# EAGLE design bluetooth (EAGLE 6.1)
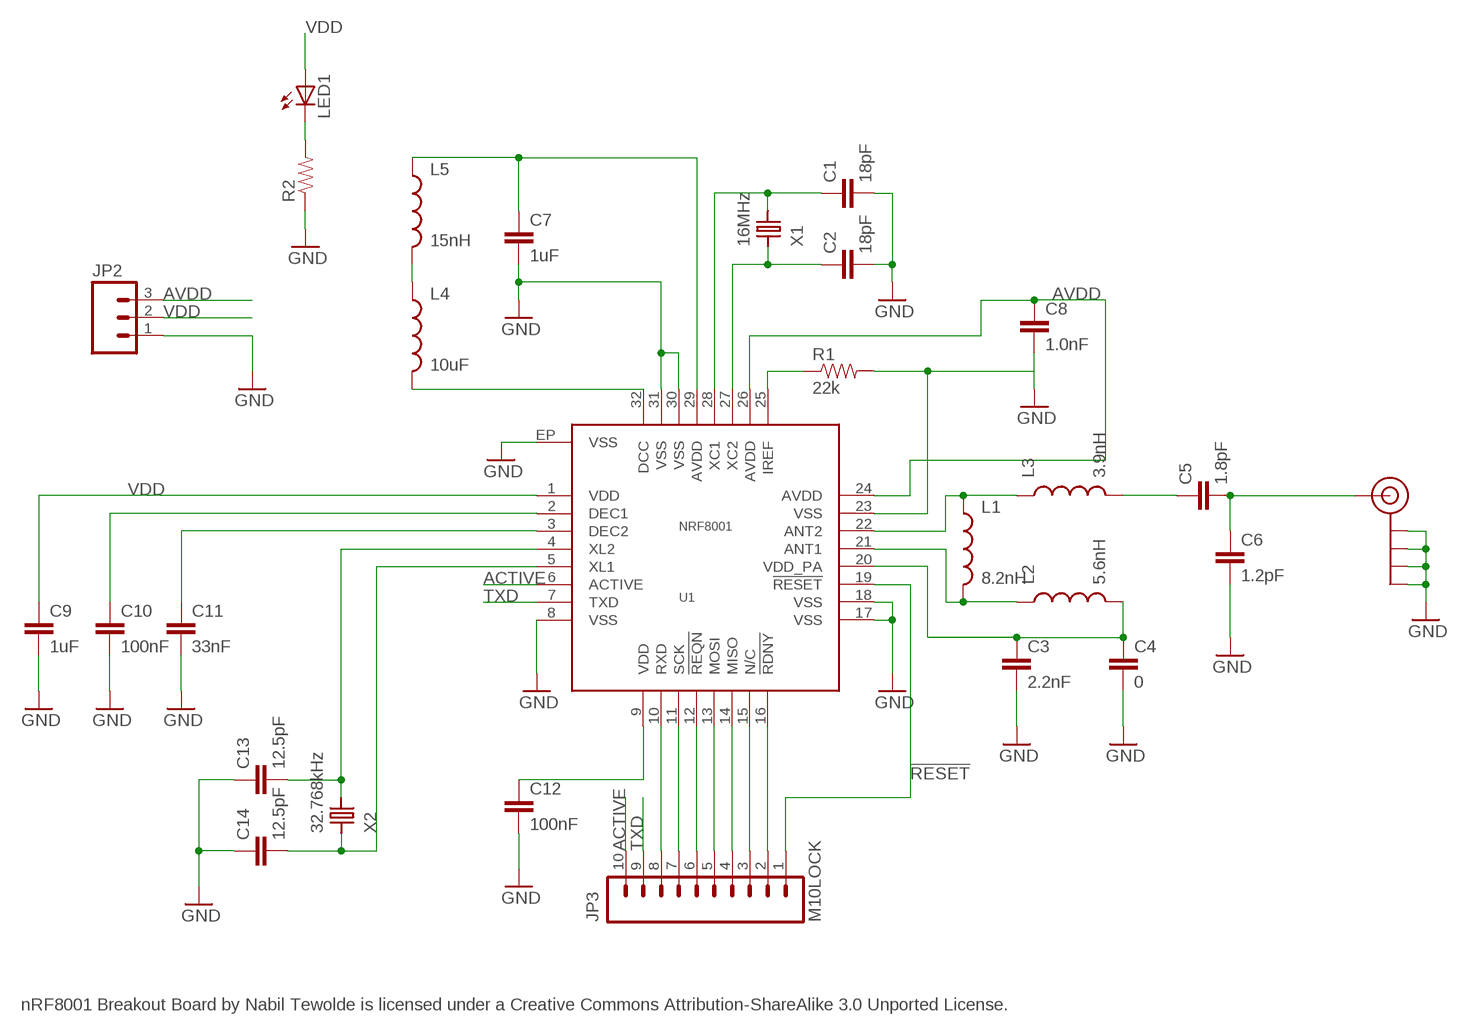
[diagram p0: schematic, sheet 1]

## Parts
C1  18pF  CAP0603-CAP  [0603-CAP]
C2  18pF  CAP0603-CAP  [0603-CAP]
C3  2.2nF  CAP0603-CAP  [0603-CAP]
C4  0  CAP0603-CAP  [0603-CAP]
C5  1.8pF  CAP0603-CAP  [0603-CAP]
C6  1.2pF  CAP0603-CAP  [0603-CAP]
C7  1uF  CAP0603-CAP  [0603-CAP]
C8  1.0nF  CAP0603-CAP  [0603-CAP]
C9  1uF  CAP0603-CAP  [0603-CAP]
C10  100nF  CAP0603-CAP  [0603-CAP]
C11  33nF  CAP0603-CAP  [0603-CAP]
C12  100nF  CAP0603-CAP  [0603-CAP]
C13  12.5pF  CAP0603-CAP  [0603-CAP]
C14  12.5pF  CAP0603-CAP  [0603-CAP]
J$1  SMA_EDGE  [SMA-EDGE]
JP2  M03LOCK  [1X03_LOCK]
JP3  M10LOCK  [1X10_LOCK]
L1  8.2nH  INDUCTOR0603  [0603]
L2  5.6nH  INDUCTOR0603  [0603]
L3  3.9nH  INDUCTOR0603  [0603]
L4  10uF  INDUCTOR0603  [0603]
L5  15nH  INDUCTOR0603  [0603]
LED1  LED0603  [LED-0603]
R1  22k  RESISTOR0603-RES  [0603-RES]
R2  RESISTOR0603-RES  [0603-RES]
U1  NRF8001  [QFN-32]
X1  16MHz  CRYSTAL-2.5X3.5  [CRYSTAL-2.5X3.5]
X2  32.768kHz  CRYSTAL-ABS10  [CRYSTAL-ABS10]

## Nets
!RESET: JP3.1 U1.19(!RESET)
ACTIVE: JP3.10 U1.6(ACTIVE)
AVDD: C8.1 JP2.3 U1.24(AVDD) U1.26(AVDD)
GND: C1.2 C2.2 C3.2 C4.2 C6.2 C7.2 C8.2 C9.2 C10.2 C11.2 C12.2 C13.1 C14.1 J$1.GND@0(GND) J$1.GND@1(GND) J$1.GND@2(GND) J$1.GND@3(GND) JP2.1 R1.2 R2.1 U1.8(VSS) U1.17(VSS) U1.18(VSS) U1.23(VSS) U1.30(VSS) U1.31(VSS) U1.EP(VSS)
N$1: L4.1 L5.2
N$2: L4.2 U1.32(DCC)
N$3: L1.1 L3.1 U1.22(ANT2)
N$4: C7.1 L5.1 U1.29(AVDD)
N$5: LED1.C R2.2
N$6: C10.1 U1.2(DEC1)
N$7: C11.1 U1.3(DEC2)
N$9: L1.2 L2.1 U1.21(ANT1)
N$10: C5.1 L3.2
N$11: C5.2 C6.1 J$1.SIG(SIGNAL)
N$12: R1.1 U1.25(IREF)
N$13: C3.1 C4.1 L2.2 U1.20(VDD_PA)
N$14: C2.1 U1.27(XC2) X1.P$1
N$15: C1.1 U1.28(XC1) X1.P$3
N$17: C13.2 U1.4(XL2) X2.P$2
N$18: C14.2 U1.5(XL1) X2.P$1
N$19: JP3.2 U1.16(!RDNY)
N$20: JP3.3 U1.15(N/C)
N$21: JP3.4 U1.14(MISO)
N$22: JP3.5 U1.13(MOSI)
N$23: JP3.6 U1.12(!REQN)
N$24: JP3.7 U1.11(SCK)
N$25: JP3.8 U1.10(RXD)
TXD: JP3.9 U1.7(TXD)
VDD: C9.1 C12.1 JP2.2 LED1.A U1.1(VDD) U1.9(VDD)

## Notes on the sheet
- nRF8001 Breakout Board by Nabil Tewolde is licensed under a Creative Commons Attribution-ShareAlike 3.0 Unported License.

## Library data of the parts
C1-C14 = SparkFun:CAP: Capacitor Standard 0603 ceramic capacitor, and 0.1" leaded capacitor.
J$1 = SparkFun:SMA_EDGE: SMA Antenna Connector End launch SMA connector. The paste layer has been removed so that the connector can be hand soldered onto the board after reflow.
JP2 = SparkFun:M03: Header 3 Standard 3-pin 0.1" header. Use with straight break away headers (SKU : PRT-00116), right angle break away headers (PRT-00553), swiss pins (PRT-00743), machine pins (PRT-00117), and female headers (PRT-00115). Molex polarized connector foot print use with SKU : PRT-08232 with associated crimp pins and housings.
JP3 = SparkFun:M10: Header 10 Standard 10-pin 0.1" header. Use with straight break away headers (SKU : PRT-00116), right angle break away headers (PRT-00553), swiss pins (PRT-00743), machine pins (PRT-00117), and female headers (PRT-00115).
L1-L5 = SparkFun:INDUCTOR: Inductors Basic Inductor/Choke - 0603 and 1206. Footprints are not proven and vary greatly between part numbers.
LED1 = SparkFun:LED: LEDs Standard schematic elements and footprints for 5mm, 3mm, 1206, and 0603 sized LEDs. 5mm - Spark Fun Electronics SKU : COM-00529 (and others)
R1 R2 = SparkFun:RESISTOR: Resistor Basic schematic elements and footprints for 0603, 1206, and PTH resistors.
U1 = FitnessDevice:NRF8001: nRF8001 is a Bluetooth® low energy solution designed for operation in the peripheral role. By integrating a Bluetooth low energy compliant radio (PHY), slave mode link controller and host, nRF8001 offers you an easy way to add Bluetooth low energy connectivity to your application.
X1 = FitnessDevice:CRYSTAL-2.5X3.5: ABRACON - ABM8G-16.000MHZ-B4Y-T - Crystal Newark Part Number: 60R3957
X2 = FitnessDevice:CRYSTAL-ABS10: ABS10-32.768KHZ-9-T

## Board
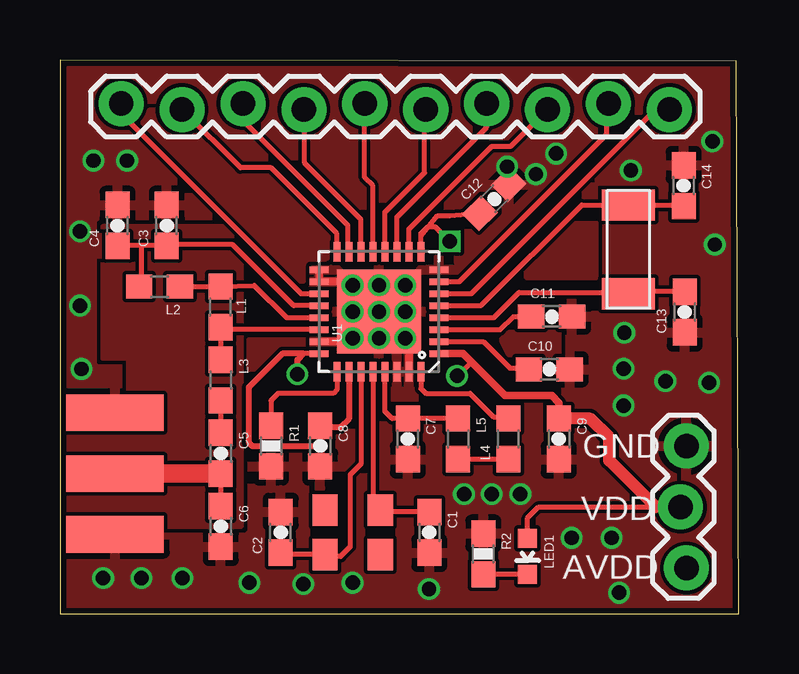
[diagram p1: board, top side]
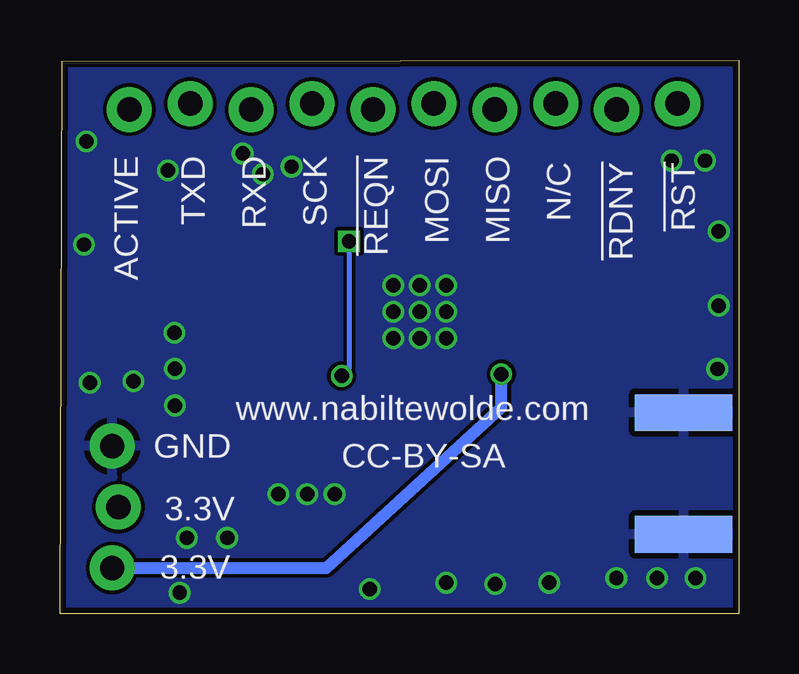
[diagram p2: board, bottom side, seen from below]

Size 28.3 x 23.1 mm. Coordinates in mm from the lower left corner, seen from the top.
Outline: 0,0 28.3,0 28.2,23.05 0,23.1 0,0
Copper layers (1*16): Top 0.035mm / dielectric 1.5mm / Bottom 0.035mm
Design rules: minimum track width 6mil, minimum drill 12mil, track to track 6mil, track to pad 6mil, pad to pad 6mil, via to via 6mil, smd to smd 0mil, copper to edge 10mil, drill to drill 10mil, minimum pad ring 10mil, minimum via ring 6mil, stop-mask expansion 2mil, vias tented up to drill 100mil, thermal gap 10mil

### Footprints (pad centres in the part's own frame; a part is rotated, then mirrored left to right if it is on the bottom)
0603-CAP = smd 1.1 x 1: 1 -0.85,0; 2 0.85,0
SMA-EDGE = smd 1.524 x 4.064: GND@0 0,0; GND@1 5.08,0; SIG 2.54,0 | smd 1.524 x 4.064 bottom: GND@2 0,0; GND@3 5.08,0
1X03_LOCK = drill 1.016 pad 1.88: 1 0,0.127; 2 2.54,-0.127; 3 5.08,0.127
1X10_LOCK = drill 1.016 pad 1.88: 1 0,0.127; 2 2.54,-0.127; 3 5.08,0.127; 4 7.62,-0.127; 5 10.16,0.127; 6 12.7,-0.127; 7 15.24,0.127; 8 17.78,-0.127; 9 20.32,0.127; 10 22.86,-0.127
0603 = smd 1.1 x 1: 1 -0.85,0; 2 0.85,0
LED-0603 = smd 0.8 x 0.8: A 0,-0.75; C 0,0.75
0603-RES = smd 1.1 x 1: 1 -0.85,0; 2 0.85,0
QFN-32 = smd 0.285 x 0.8: 1 -1.75,-2.5; 2 -1.25,-2.5; 3 -0.75,-2.5; 4 -0.25,-2.5; 5 0.25,-2.5; 6 0.75,-2.5; 7 1.25,-2.5; 8 1.75,-2.5; 17 1.75,2.5; 18 1.25,2.5; 19 0.75,2.5; 20 0.25,2.5; 21 -0.25,2.5; 22 -0.75,2.5; 23 -1.25,2.5; 24 -1.75,2.5 | smd 0.8 x 0.285: 9 2.5,-1.75; 10 2.5,-1.25; 11 2.5,-0.75; 12 2.5,-0.25; 13 2.5,0.25; 14 2.5,0.75; 15 2.5,1.25; 16 2.5,1.75; 25 -2.5,1.75; 26 -2.5,1.25; 27 -2.5,0.75; 28 -2.5,0.25; 29 -2.5,-0.25; 30 -2.5,-0.75; 31 -2.5,-1.25; 32 -2.5,-1.75 | smd 3.5 x 3.5: EP 0,0
CRYSTAL-2.5X3.5 = smd 1.05 x 1.3: P$1 -1.15,-0.925; P$2 1.15,-0.925; P$3 1.15,0.925; P$4 -1.15,0.925
CRYSTAL-ABS10 = smd 1.3 x 2.2: P$1 -1.85,0; P$2 1.85,0

### Placement (x,y rotation side)
C1  15.4,3.4 270 top
C2  9.2,3.4 90 top
C3  4.45,16.2 90 top
C4  2.4,16.2 90 top
C5  6.7,6.7 270 top
C6  6.7,3.65 270 top
C7  14.5,7.3 270 top
C8  10.85,7 270 top
C9  20.8,7.3 270 top
C10  20.4,10.2 0 top
C11  20.5,12.4 0 top
C12  18.11,17.31 45 top
C13  26.05,12.59 90 top
C14  26,17.86 270 top
J$1  2.29,8.4 270 top
JP2  26,7 270 top
JP3  2.55,21.16 0 top
L1  6.7,12.8 90 top
L2  4.15,13.65 180 top
L3  6.7,9.75 270 top
L4  18.7,7.3 90 top
L5  16.6,7.3 270 top
LED1  19.5,2.4 180 top
R1  8.8,7 270 top
R2  17.65,2.5 270 top
U1  13.3,12.6 90 top
X1  12.2,3.4 0 top
X2  23.7,15.2 270 top

### Tracks (layer width: path | path; a pad name or v marks a point on that pad's centre or on a via)
!RESET
  Top 0.203: JP3.1 2.55,20.85 10.05,13.35 U1.19 | U1.19
ACTIVE
  Top 0.203: U1.6 17.15,13.35 24.6,20.8 25.18,20.8 JP3.10
AVDD  (via drill 0.6)
  Top 0.203: 10.85,7.9 C8.1 10.8,7.85 | U1.24 10.15,10.85
  Top 0.254: v9.9,10 9.9,10.6 10.15,10.85 9.27,10.85 7.87,9.44 7.87,7.16 8.02,7.01 10.66,7.01 10.85,7.2 C8.1 10.93,7.77 11.68,7.77 12.05,8.14 U1.26
  Bottom 0.508: JP2.3 17.19,1.92 9.9,8.6 v9.9,10
GND  (via drill 0.6)
  Top 0.203: U1.EP 13.2,12.6 U1.EP
  Top 0.305: v12.2,13.7 12.05,13.85 U1.18 U1.17 | U1.23 12.05,11.35 v12.2,11.5 | U1.31 14.55,11.35 v14.4,11.5
  Bottom 0.203: U1.EP 13.2,12.5 13.2,12.4
  other vias: 14.4,13.7 13.3,13.7 13.3,12.6 13.3,11.5 12.2,12.6 14.4,12.6 18.64,18.65 19.84,18.34 23.53,11.72 27.06,9.64 23.5,10.23 23.5,8.69 1.4,18.9 23.8,18.5 18,5 19.2,5 1.8,1.5 3.4,1.5 5.1,1.5 7.9,1.3 2.8,18.9 25.24,9.71 12.2,1.3 27.2,19.7 27.3,15.4 16.85,5 10.15,1.25 0.89,10.21 0.84,12.86 0.84,15.96 20.68,19.2 21.33,3.17 23.01,3.17 23.31,0.89 15.39,1.04
  pour Top (rank 3): 0.4,0.3 0.4,22.66 27.9,22.66 27.9,0.3
  pour Bottom (rank 3): 0.4,0.3 0.4,22.66 27.9,22.66 27.9,0.3
N$1
  Top 0.203: L4.1 L5.2
N$2
  Top 0.203: U1.32 15.05,9.4 15.25,9.2 17.1,9.2 18.1,8.2 18.65,8.2 L4.2
N$3
  Top 0.203: U1.22 6.8,11.85 L1.1 L3.1
N$4
  Top 0.203: 13.55,10.05 13.55,8.45 13.85,8.15 C7.1 L5.1 | U1.29 13.55,10.05 | 13.55,10.05
N$5
  Top 0.203: LED1.C R2.2
N$6
  Top 0.203: U1.2 17.65,11.35 18.75,10.25 19.5,10.25 C10.1
N$7
  Top 0.203: U1.3 18.35,11.85 18.9,12.4 C11.1 | C11.1
N$9
  Top 0.203: L2.1 L1.2 8.1,13.7 9.45,12.35 U1.21 | U1.21
N$10
  Top 0.203: L3.2 C5.1
N$11
  Top 0.203: C5.2 C6.1
  Top 0.762: C5.2 2.46,5.85 J$1.SIG
N$12
  Top 0.203: U1.25 11.55,9.35 11.4,9.2 9.1,9.2 8.8,8.9 R1.1
N$13
  Top 0.203: U1.20 9.75,12.85 7.2,15.4 4.45,15.4 C3.1 3.35,15.35 | 3.35,15.35 C4.1 | L2.2 3.25,13.85 3.4,14 3.4,15.3 3.35,15.35
N$14
  Top 0.203: U1.27 12.55,6.25 12.1,5.8 12.1,2.8 11.7,2.4 11.12,2.4 X1.P$1 9.28,2.47 C2.1
N$15
  Top 0.203: U1.28 13.05,4.62 X1.P$3 13.43,4.25 C1.1
N$17
  Top 0.203: U1.4 18.09,12.35 19.14,13.41 23.64,13.41 X2.P$2 | 23.7,13.75 X2.P$2 | C13.2 23.79,13.44 X2.P$2
N$18
  Top 0.203: U1.5 17.55,12.85 21.75,17.05 X2.P$1 | X2.P$1 | X2.P$1 25.96,17.05 C14.2
N$19
  Top 0.203: U1.16 11.55,15.85 8.8,18.6 7.52,18.6 JP3.2
N$20
  Top 0.203: U1.15 12,15.15 12,16.2 7.6,20.6 7.6,21.25 JP3.3
N$21
  Top 0.203: U1.14 12.55,16.45 10.2,18.8 10.2,21 JP3.4
N$22
  Top 0.203: U1.13 13.05,17.85 12.7,18.2 JP3.5
N$23
  Top 0.203: U1.12 13.55,16.75 15.2,18.4 15.2,20.98 JP3.6
N$24
  Top 0.203: U1.11 14.05,16.55 17.8,20.3 JP3.7
N$25
  Top 0.203: U1.10 14.55,16.05 18,19.5 18.8,19.5 JP3.8
TXD
  Top 0.203: U1.7 16.65,13.85 22.8,20 22.8,21.21 JP3.9
VDD  (via drill 0.6)
  Top 0.203: LED1.A 19.49,4 19.95,4.46 25.3,4.46 | C12.1 16.24,16.61 16.25,16.61 16.1,16.6 15.75,16.6 15.05,15.75 U1.9 15.05,15.86 15.34,16.15 15.64,16.15 v16.25,15.54 | v16.55,9.93 17.15,10.5
  Top 0.305: C9.1 20.8,8.8 20.5,9.1 18.55,9.1 17.15,10.5 16.8,10.85 U1.1 | U1.1
  Top 0.508: JP2.2 25.3,4.46 24.84,4.46 22.9,6.4 22.9,7.35 22.1,8.15 C9.1 | C9.1
  Bottom 0.203: v16.25,15.54 16.25,10.21 v16.55,9.93
  pour Top: 1.77,16.15 1.77,10.66 2.84,10.66 2.84,3.65 7.56,3.65 7.56,15.69 7.11,16.15
  pour Top: 0.25,7.62 0.25,4.26 3.3,4.26 3.3,7.62
  pour Top: 11.37,15.08 11.07,14.78 10.31,14.78 10.15,14.63 10.15,13.86 10,13.86 3.45,20.42 3.45,20.72 3.75,21.03 4.67,21.03 7.41,18.28 8.63,18.28 8.78,18.28 11.37,15.69
  pour Top: 18.38,11.43 18.69,10.82 20.82,10.82 20.82,11.73 18.69,11.73
  pour Top: 22.35,16.3 22.35,14.17 22.35,14.02 19.45,14.02 19.45,14.32 21.43,16.3
  pour Top: 7.87,11.43 7.87,10.21 8.17,10.21 9.09,11.12 10.46,11.12 10.61,11.12 10.61,11.43
  pour Top: 11.37,13.1 11.37,11.88 11.43,11.88 11.45,11.9 11.45,13.1
  pour Top: 12.55,14.45 13.95,14.45 13.95,14.5 12.55,14.5
  pour Top: 15.1,11.75 15.1,13.65 15.2,13.65 15.2,11.75
  pour Top: 12.55,10.8 14.05,10.8 14.05,10.75 12.55,10.75

### Text on the board
tNames: GND | VDD | AVDD
bNames: !RST | !RDNY | N/C | MISO | MOSI | !REQN | SCK | RXD | TXD | ACTIVE | www.nabiltewolde.com | CC-BY-SA | GND | 3.3V | 3.3V